# Altium project TIDA-010933-RevA.PrjPcb (part 7 of 8)

## Sheet TIDA-010933-DCAC-SWITCHING-STAGE.SchDoc
size 558 x 431 mm; Date: Not shown in title block; ApprovedBy: Not shown in title block; CheckedBy: Not shown in title block; Author: Not shown in title block; CompanyName: Not shown in title block; Engineer: Not shown in title block; Organization: Not shown in title block; Address1: Not shown in title block; Address2: Not shown in title block; Address3: Not shown in title block; Address4: Not shown in title block; DocumentNumber: 1; Revision: Use project parameter SCH_Rev; SheetNumber: 11; SheetTotal: 11; PageSetup: Record=PageOptions|CenterHorizontal=True|CenterVertical=True|PrintScale=1.00|XCorrection=1.00|YCorrection=1.00|PrintKind=0|BorderSize=5000000|LeftOffset=0|BottomOffset=0|Orientation=2|PaperLength=1000|PaperWidth=1000|Scale=100|PaperSource=15|PrintQuality=600|MediaType=1|DitherType=10|PaperKind=Letter|PrintScaleMode=1; CurrentTime: Not shown in title block; CurrentDate: Not shown in title block; Time: Not shown in title block; DocumentFullPathAndName: Not shown in title block; DocumentName: Not shown in title block; ModifiedDate: Not shown in title block; ImagePath: Not shown in title block
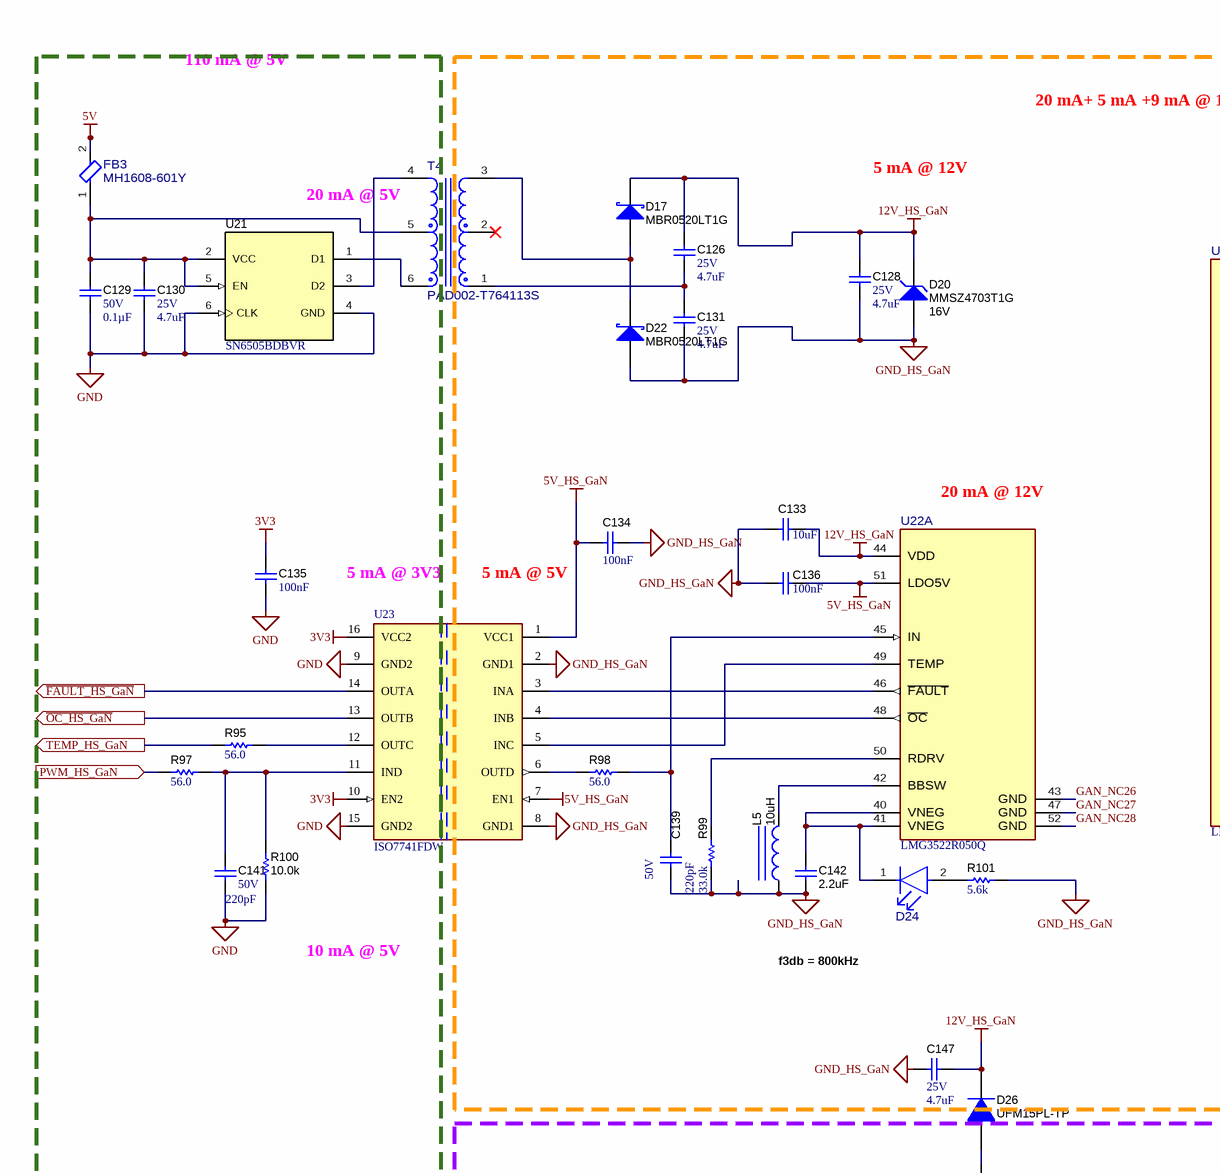
[diagram p12: TIDA-010933-DCAC-SWITCHING-STAGE.SchDoc, top left]
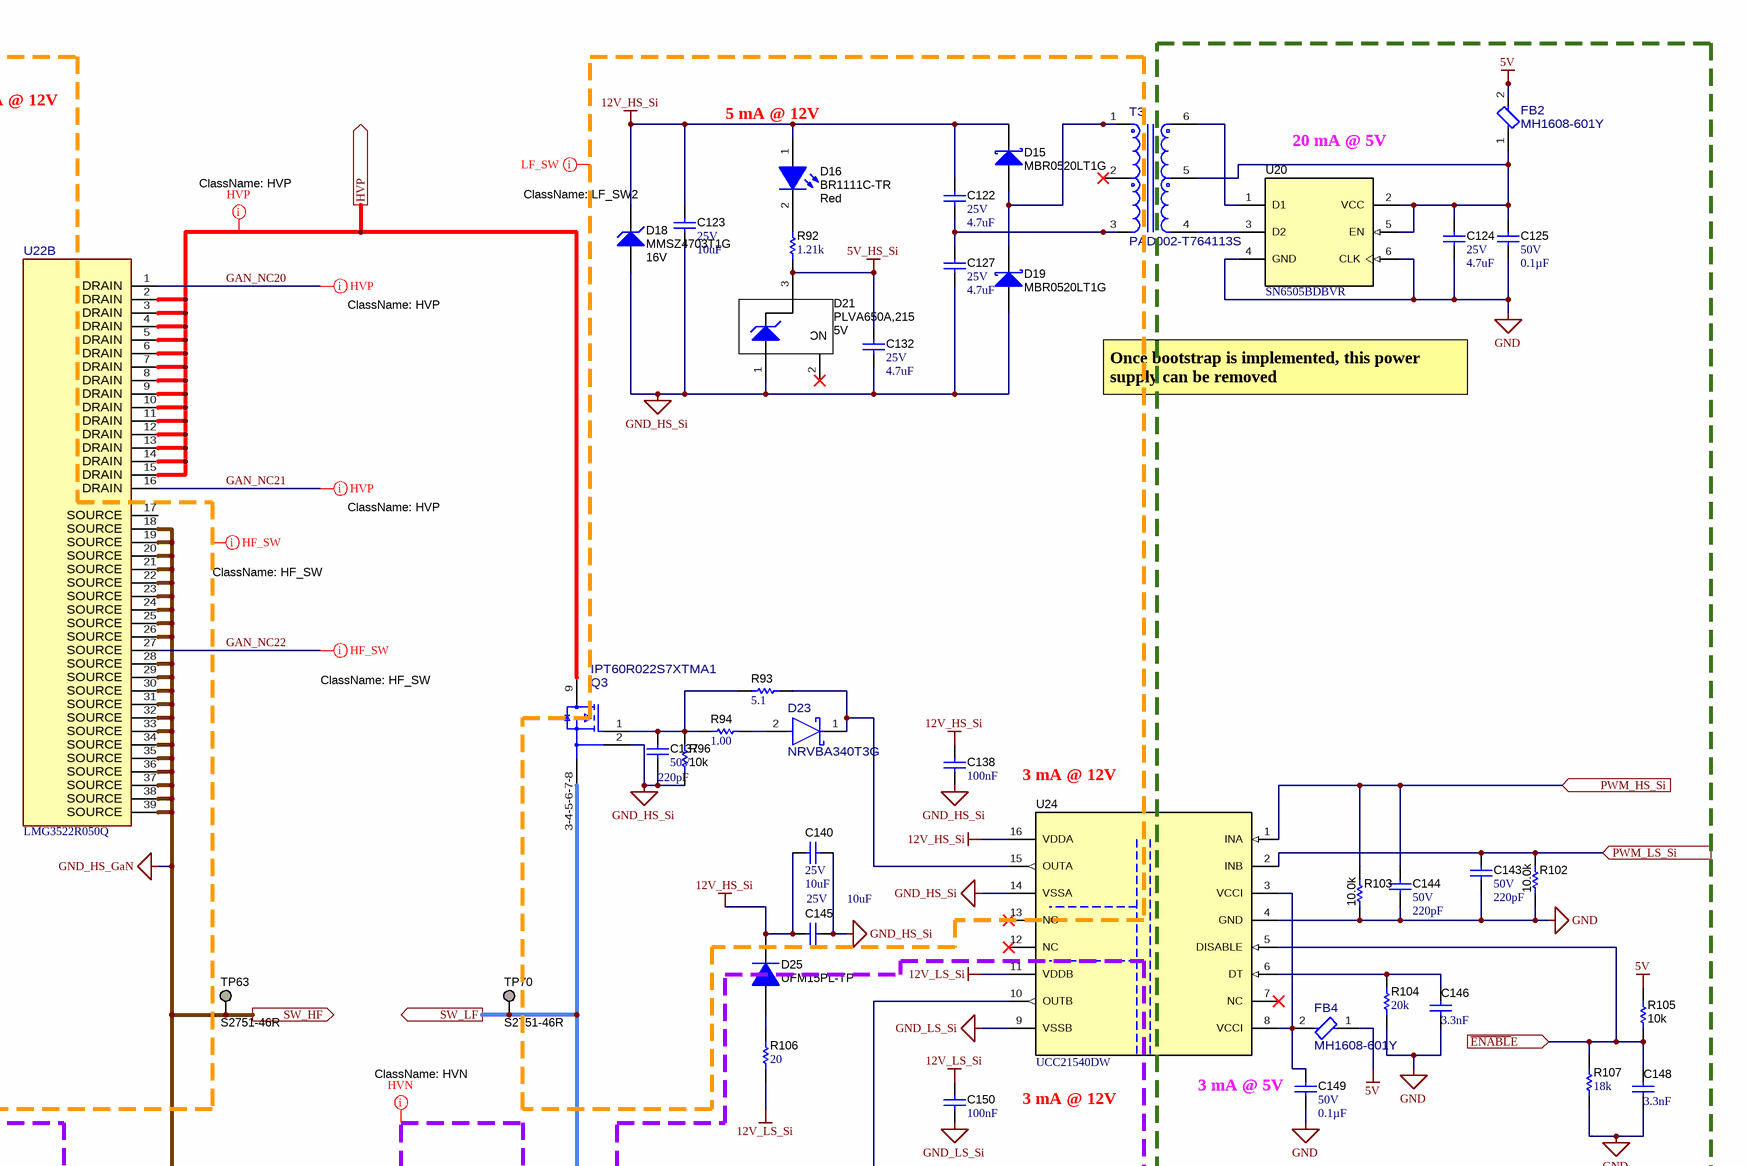
[diagram p13: TIDA-010933-DCAC-SWITCHING-STAGE.SchDoc, top right]
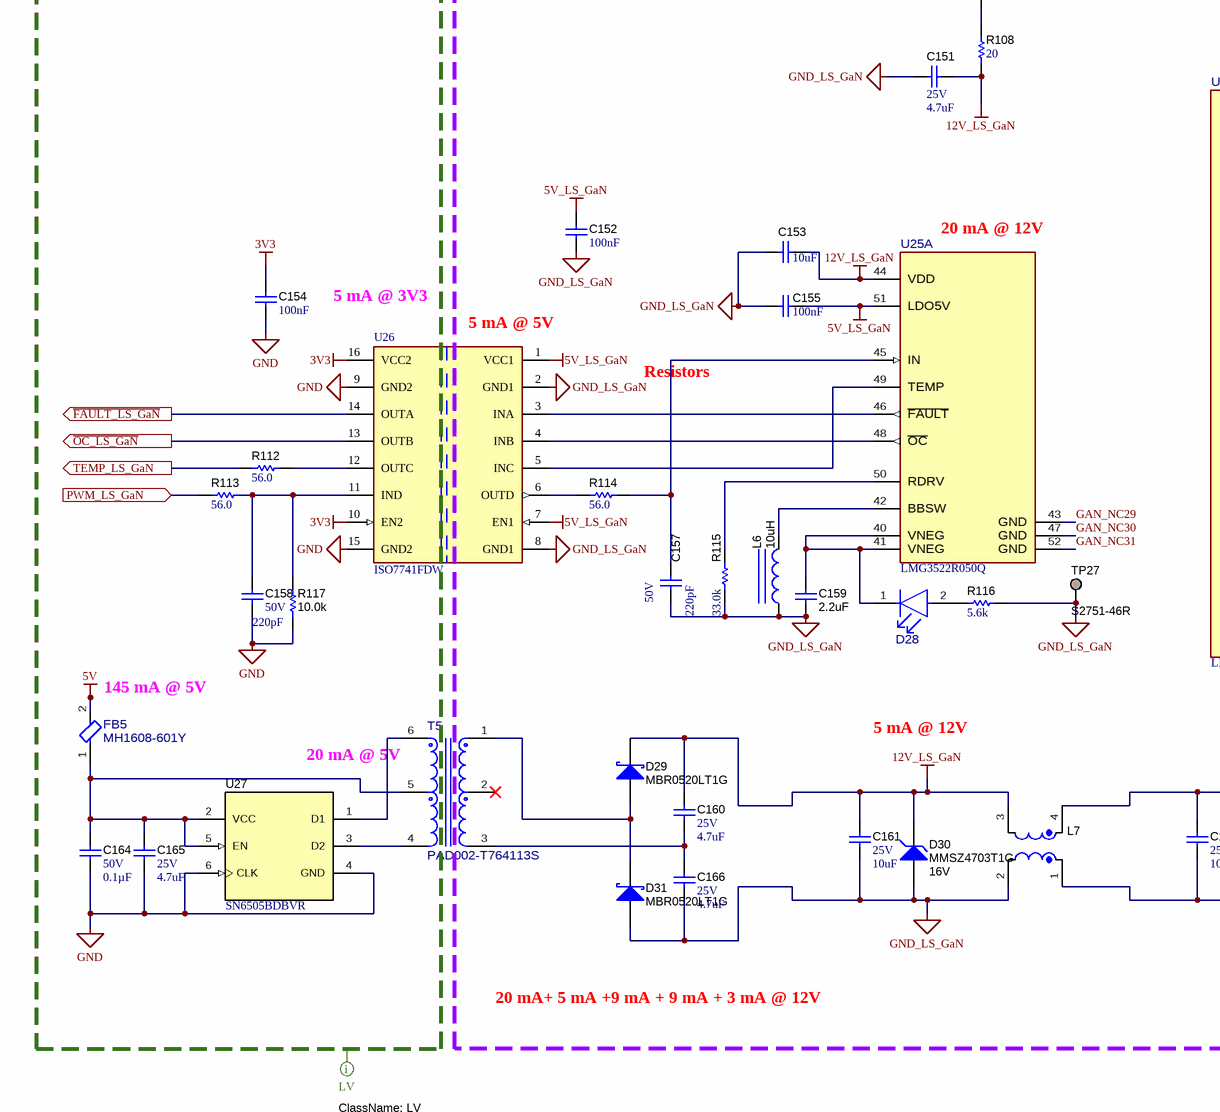
[diagram p14: TIDA-010933-DCAC-SWITCHING-STAGE.SchDoc, bottom left]
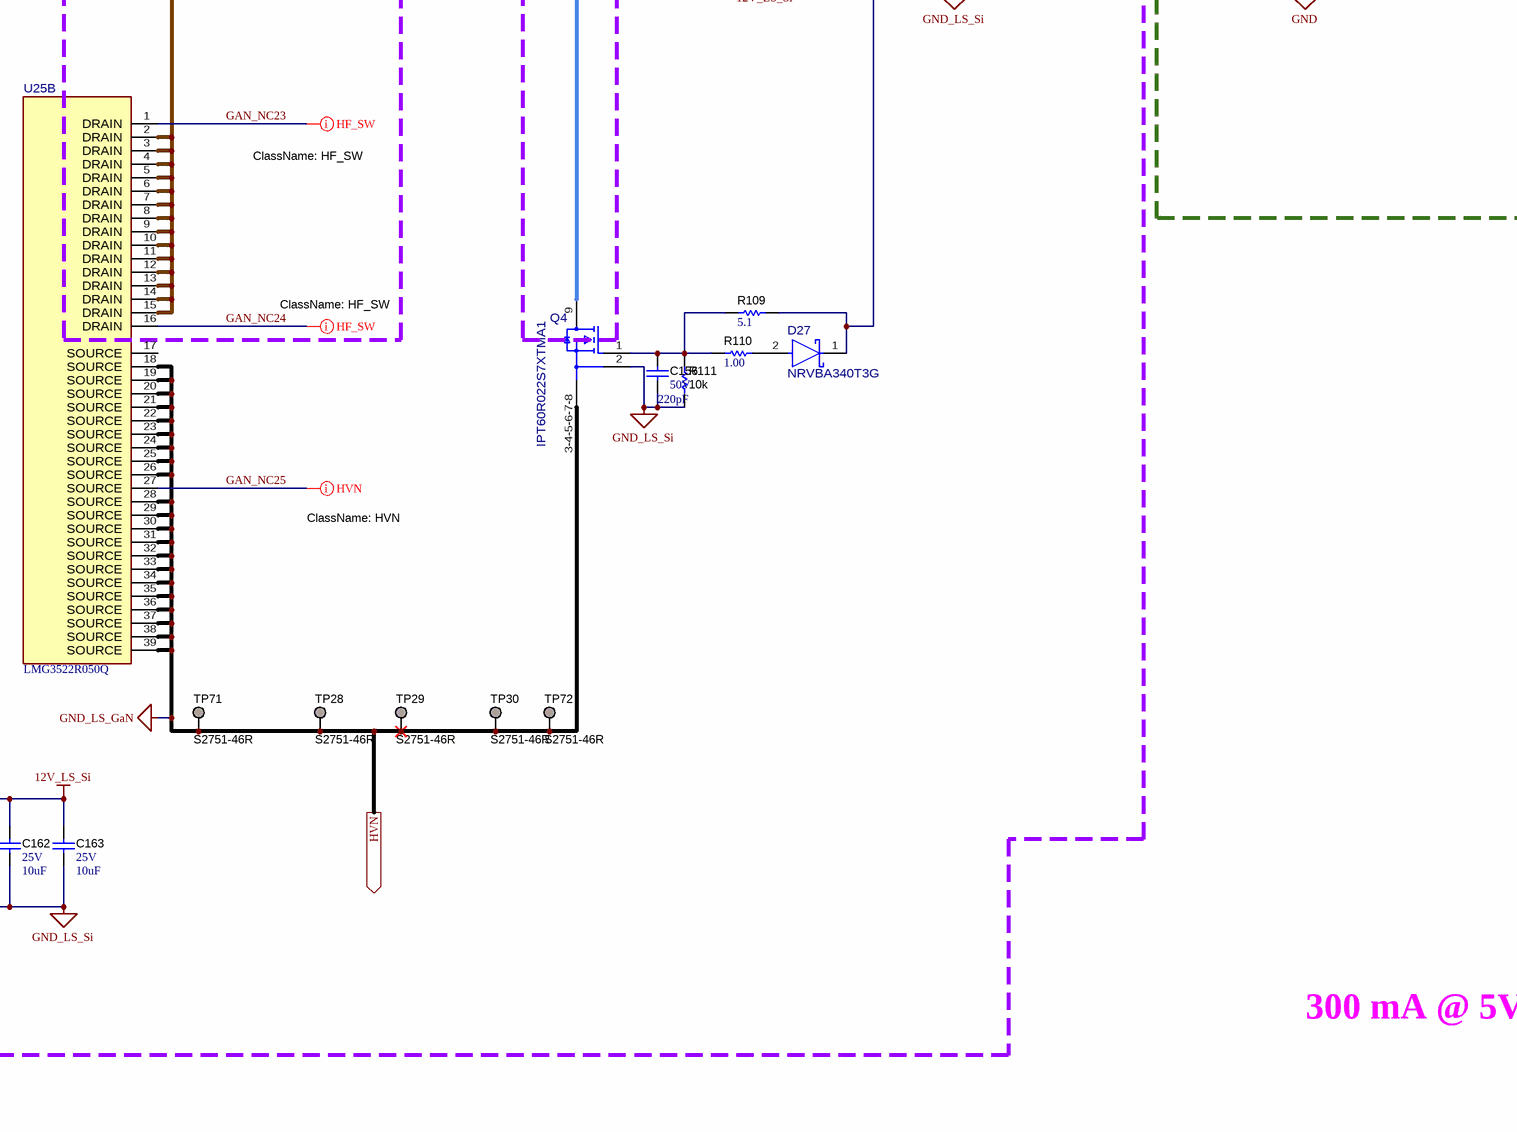
[diagram p15: TIDA-010933-DCAC-SWITCHING-STAGE.SchDoc, bottom right]

### Parts
C122  VDC_V: 25V  ValueDisplayed: 4.7uF  [0603]  (hidden comment: GRM188R61E475KE11D)
C123  VDC_V: 25V  ValueDisplayed: 10uF  [0603]  (hidden comment: GRM188R61E106MA73D)
C124  VDC_V: 25V  ValueDisplayed: 4.7uF  [0603]  (hidden comment: GRM188R61E475KE11D)
C125  VDC_V: 50V  ValueDisplayed: 0.1µF  [0603]  (hidden comment: CGA3E3X8R1H104K080AE)
C126  VDC_V: 25V  ValueDisplayed: 4.7uF  [0603]  (hidden comment: GRM188R61E475KE11D)
C127  VDC_V: 25V  ValueDisplayed: 4.7uF  [0603]  (hidden comment: GRM188R61E475KE11D)
C128  VDC_V: 25V  ValueDisplayed: 4.7uF  [0603]  (hidden comment: GRM188R61E475KE11D)
C129  VDC_V: 50V  ValueDisplayed: 0.1µF  [0603]  (hidden comment: CGA3E3X8R1H104K080AE)
C130  VDC_V: 25V  ValueDisplayed: 4.7uF  [0603]  (hidden comment: GRM188R61E475KE11D)
C131  VDC_V: 25V  ValueDisplayed: 4.7uF  [0603]  (hidden comment: GRM188R61E475KE11D)
C132  VDC_V: 25V  ValueDisplayed: 4.7uF  [0603]  (hidden comment: GRM188R61E475KE11D)
C133  ValueDisplayed: 10uF  [0805_HV]  (hidden comment: GRM219B31E106MA12)
C134  Cap_F: 100nF  [0603]  (hidden comment: 06033C104JAT2A)
C135  Cap_F: 100nF  [0603]  (hidden comment: 06033C104JAT2A)
C136  Cap_F: 100nF  [0603]  (hidden comment: 06033C104JAT2A)
C137  VDC_V: 50V  ValueDisplayed: 220pF  [0603]  (hidden comment: C0603C221K5GACTU)
C138  Cap_F: 100nF  [0603]  (hidden comment: 06033C104JAT2A)
C139  VDC_V: 50V  ValueDisplayed: 220pF  [0603]  (hidden comment: C0603C221K5GACTU)
C140  VDC_V: 25V  ValueDisplayed: 10uF  [0603]  (hidden comment: GRM188R61E106MA73D)
C141  VDC_V: 50V  ValueDisplayed: 220pF  [0603]  (hidden comment: C0603C221K5GACTU)
C142  ValueDisplayed: 2.2uF  [0805_HV]  (hidden comment: GRM21BR71E225KA73L)
C143  VDC_V: 50V  ValueDisplayed: 220pF  [0603]  (hidden comment: C0603C221K5GACTU)
C144  VDC_V: 50V  ValueDisplayed: 220pF  [0603]  (hidden comment: C0603C221K5GACTU)
C145  VDC_V: 25V  ValueDisplayed: 10uF  [0603]  (hidden comment: GRM188R61E106MA73D)
C146  Cap_F: 3.3nF  [0603]  (hidden comment: C0603X332K5RACTU)
C147  VDC_V: 25V  ValueDisplayed: 4.7uF  [0603]  (hidden comment: GRM188R61E475KE11D)
C148  Cap_F: 3.3nF  [0603]  (hidden comment: C0603X332K5RACTU)
C149  VDC_V: 50V  ValueDisplayed: 0.1µF  [0603]  (hidden comment: CGA3E3X8R1H104K080AE)
C150  Cap_F: 100nF  [0603]  (hidden comment: 06033C104JAT2A)
C151  VDC_V: 25V  ValueDisplayed: 4.7uF  [0603]  (hidden comment: GRM188R61E475KE11D)
C152  Cap_F: 100nF  [0603]  (hidden comment: 06033C104JAT2A)
C153  ValueDisplayed: 10uF  [0805_HV]  (hidden comment: GRM219B31E106MA12)
C154  Cap_F: 100nF  [0603]  (hidden comment: 06033C104JAT2A)
C155  Cap_F: 100nF  [0603]  (hidden comment: 06033C104JAT2A)
C156  VDC_V: 50V  ValueDisplayed: 220pF  [0603]  (hidden comment: C0603C221K5GACTU)
C157  VDC_V: 50V  ValueDisplayed: 220pF  [0603]  (hidden comment: C0603C221K5GACTU)
C158  VDC_V: 50V  ValueDisplayed: 220pF  [0603]  (hidden comment: C0603C221K5GACTU)
C159  ValueDisplayed: 2.2uF  [0805_HV]  (hidden comment: GRM21BR71E225KA73L)
C160  VDC_V: 25V  ValueDisplayed: 4.7uF  [0603]  (hidden comment: GRM188R61E475KE11D)
C161  VDC_V: 25V  ValueDisplayed: 10uF  [0603]  (hidden comment: GRM188R61E106MA73D)
C162  VDC_V: 25V  ValueDisplayed: 10uF  [0603]  (hidden comment: GRM188R61E106MA73D)
C163  VDC_V: 25V  ValueDisplayed: 10uF  [0603]  (hidden comment: GRM188R61E106MA73D)
C164  VDC_V: 50V  ValueDisplayed: 0.1µF  [0603]  (hidden comment: CGA3E3X8R1H104K080AE)
C165  VDC_V: 25V  ValueDisplayed: 4.7uF  [0603]  (hidden comment: GRM188R61E475KE11D)
C166  VDC_V: 25V  ValueDisplayed: 4.7uF  [0603]  (hidden comment: GRM188R61E475KE11D)
D15  MBR0520LT1G  [SOD-123]
D16  BR1111C-TR  value Red  [1111C_Red]
D17  MBR0520LT1G  [SOD-123]
D18  MMSZ4703T1G  value 16V  [SOD-123]
D19  MBR0520LT1G  [SOD-123]
D20  MMSZ4703T1G  value 16V  [SOD-123]
D21  PLVA650A,215  value 5V  [SOT-23L]
D22  MBR0520LT1G  [SOD-123]
D23  NRVBA340T3G  [FP-NRVBA340T3G_SMA-MFG]
D24  KG DELLS1.22-JGKH-24  [FP-KG DELLS1.22-JGKH-24_0603-MFG]  (value not drawn)
D25  UFM15PL-TP  [SOD-123FL]
D26  UFM15PL-TP  [SOD-123FL]
D27  NRVBA340T3G  [FP-NRVBA340T3G_SMA-MFG]
D28  KG DELLS1.22-JGKH-24  [FP-KG DELLS1.22-JGKH-24_0603-MFG]  (value not drawn)
D29  MBR0520LT1G  [SOD-123]
D30  MMSZ4703T1G  value 16V  [SOD-123]
D31  MBR0520LT1G  [SOD-123]
FB2  MH1608-601Y  [FP-MH1608-601Y_0603-MFG]
FB3  MH1608-601Y  [FP-MH1608-601Y_0603-MFG]
FB4  MH1608-601Y  [FP-MH1608-601Y_0603-MFG]
FB5  MH1608-601Y  [FP-MH1608-601Y_0603-MFG]
L5  ValueDisplayed: 10uH  [WE-LQS_2010]  (hidden comment: 74404020100)
L6  ValueDisplayed: 10uH  [WE-LQS_2010]  (hidden comment: 74404020100)
L7  SRF2012-361YA  [SRF2012A]  (value not drawn)
Q3  IPT60R022S7XTMA1  [FP-IPT60R022S7XTMA1_HSOF8-MFG]
Q4  IPT60R022S7XTMA1  [FP-IPT60R022S7XTMA1_HSOF8-MFG]
R92  ValueDisplayed: 1.21k  [0805_HV]  (hidden comment: CRCW08051K21FKEA)
R93  ValueDisplayed: 5.1  [0603]  (hidden comment: CRCW06035R10JNEA)
R94  ValueDisplayed: 1.00  [0603]  (hidden comment: CRCW06031R00FKEA)
R95  ValueDisplayed: 56.0  [0603]  (hidden comment: RC0603FR-0756RL)
R96  ValueDisplayed: 10k  [0603]  (hidden comment: CRCW060310K0JNEA)
R97  ValueDisplayed: 56.0  [0603]  (hidden comment: RC0603FR-0756RL)
R98  ValueDisplayed: 56.0  [0603]  (hidden comment: RC0603FR-0756RL)
R99  ValueDisplayed: 33.0k  [0603]  (hidden comment: RC0603FR-0733KL)
R100  ValueDisplayed: 10.0k  [0603]  (hidden comment: CRCW060310K0FKEA)
R101  ValueDisplayed: 5.6k  [0603]  (hidden comment: RC0603JR-075K6L)
R102  ValueDisplayed: 10.0k  [0603]  (hidden comment: CRCW060310K0FKEA)
R103  ValueDisplayed: 10.0k  [0603]  (hidden comment: CRCW060310K0FKEA)
R104  ValueDisplayed: 20k  [0603]  (hidden comment: CRCW060320K0JNEA)
R105  ValueDisplayed: 10k  [0603]  (hidden comment: CRCW060310K0JNEA)
R106  ValueDisplayed: 20  [0603]  (hidden comment: CRCW060320R0JNEA)
R107  ValueDisplayed: 18k  [0603]  (hidden comment: RC0603JR-0718KL)
R108  ValueDisplayed: 20  [0603]  (hidden comment: CRCW060320R0JNEA)
R109  ValueDisplayed: 5.1  [0603]  (hidden comment: CRCW06035R10JNEA)
R110  ValueDisplayed: 1.00  [0603]  (hidden comment: CRCW06031R00FKEA)
R111  ValueDisplayed: 10k  [0603]  (hidden comment: CRCW060310K0JNEA)
R112  ValueDisplayed: 56.0  [0603]  (hidden comment: RC0603FR-0756RL)
R113  ValueDisplayed: 56.0  [0603]  (hidden comment: RC0603FR-0756RL)
R114  ValueDisplayed: 56.0  [0603]  (hidden comment: RC0603FR-0756RL)
R115  ValueDisplayed: 33.0k  [0603]  (hidden comment: RC0603FR-0733KL)
R116  ValueDisplayed: 5.6k  [0603]  (hidden comment: RC0603JR-075K6L)
R117  ValueDisplayed: 10.0k  [0603]  (hidden comment: CRCW060310K0FKEA)
T3  PAD002-T764113S  [FP-PAD002-T764113S_SMT_XFRMR_7MM1_6MM5-MFG]
T4  PAD002-T764113S  [FP-PAD002-T764113S_SMT_XFRMR_7MM1_6MM5-MFG]
T5  PAD002-T764113S  [FP-PAD002-T764113S_SMT_XFRMR_7MM1_6MM5-MFG]
TP27  S2751-46R  [Harwin_S2751-46R]  (no BOM)
TP28  S2751-46R  [Harwin_S2751-46R]  (no BOM)
TP29  S2751-46R  [Harwin_S2751-46R]  (no BOM)
TP30  S2751-46R  [Harwin_S2751-46R]  (no BOM)
TP63  S2751-46R  [Harwin_S2751-46R]  (no BOM)
TP70  S2751-46R  [Harwin_S2751-46R]  (no BOM)
TP71  S2751-46R  [Harwin_S2751-46R]  (no BOM)
TP72  S2751-46R  [Harwin_S2751-46R]  (no BOM)
U20  SN6505BDBVR  [DBV0006A_L]
U21  SN6505BDBVR  [DBV0006A_L]
U22  PartNumber: LMG3522R050Q  [RQS0052C-C01-MFG]  (hidden comment: LMG3522R030Q)  (parts A,B of 2)
U23  ISO7741FDW  [FP-DW0016A-IPC_A]
U24  UCC21540DW  [DW0016B_HV]
U25  PartNumber: LMG3522R050Q  [RQS0052C-C01-MFG]  (hidden comment: LMG3522R030Q)  (parts A,B of 2)
U26  ISO7741FDW  [FP-DW0016A-IPC_A]
U27  SN6505BDBVR  [DBV0006A_L]

### Ports
HVN (out), HVP (out), PWM_HS_GaN (in), PWM_HS_Si (in), PWM_LS_GaN (in), PWM_LS_Si (in), SW_HF (out), SW_LF (out), TEMP_HS_GaN (out), TEMP_LS_GaN (out), ~{ENABL}E (in), ~{FAULT_HS_GaN} (out), ~{FAULT_LS_GaN} (out), ~{OC_HS_GaN} (out), ~{OC_LS_GaN} (out)

### Nets
3V3: C135.1 C154.1 U23.10(EN2) U23.16(VCC2) U26.10(EN2) U26.16(VCC2)
5V: FB2.2 FB3.2 FB4.1 FB5.2 R105.2
5V_HS_GaN: C134.1 C136.2 U22.51(LDO5V) U23.1(VCC1) U23.7(EN1)
5V_HS_Si: C132.1 D21.3(K) R92.1
5V_LS_GaN: C152.2 C155.2 U25.51(LDO5V) U26.1(VCC1) U26.7(EN1)
12V_HS_GaN: C126.1 C128.1 C133.2 C147.1 D17.1(K) D20.1(K) D26.1(K) U22.44(VDD)
12V_HS_Si: C122.1 C123.1 C138.2 C140.1 C145.2 D15.1(K) D16.1(A) D18.1(K) D25.1(K) U24.16(VDDA)
12V_LS_GaN: C151.1 C153.2 C160.1 C161.2 D29.1(K) D30.1(K) L7.3 R108.1 U25.44(VDD)
12V_LS_Si: C150.2 C162.2 C163.2 L7.4 R106.1 U24.11(VDDB)
GND: C124.2 C125.2 C129.2 C130.2 C135.2 C141.2 C143.2 C144.2 C146.2 C148.2 C149.2 C154.2 C158.2 C164.2 C165.2 R100.1 R102.1 R103.1 R104.1 R107.1 R117.1 U20.4(GND) U20.6(CLK) U21.4(GND) U21.6(CLK) U23.9(GND2) U23.15(GND2) U24.4(GND) U26.9(GND2) U26.15(GND2) U27.4(GND) U27.6(CLK)
GND_HS_GaN: C128.2 C131.2 C133.1 C134.2 C136.1 C139.2 C142.2 C147.2 D20.2(A) D22.2(A) L5.1 R99.2 R101.1 TP63.1 U22.18(SOURCE) U22.19(SOURCE) U22.20(SOURCE) U22.21(SOURCE) U22.22(SOURCE) U22.23(SOURCE) U22.24(SOURCE) U22.25(SOURCE) U22.26(SOURCE) U22.28(SOURCE) U22.29(SOURCE) U22.30(SOURCE) U22.31(SOURCE) U22.32(SOURCE) U22.33(SOURCE) U22.34(SOURCE) U22.35(SOURCE) U22.36(SOURCE) U22.37(SOURCE) U22.38(SOURCE) U22.39(SOURCE) U23.2(GND1) U23.8(GND1) U25.2(DRAIN) U25.3(DRAIN) U25.4(DRAIN) U25.5(DRAIN) U25.6(DRAIN) U25.7(DRAIN) U25.8(DRAIN) U25.9(DRAIN) U25.10(DRAIN) U25.11(DRAIN) U25.12(DRAIN) U25.13(DRAIN) U25.14(DRAIN) U25.15(DRAIN) ; port SW_HF
GND_HS_Si: C123.2 C127.2 C132.2 C137.2 C138.1 C140.2 C145.1 D18.2(A) D19.2(A) D21.1(A) Q3.2(Driver_Source) Q3.3-4-5-6-7-8(Source) Q4.9(Drain) R96.1 TP70.1 U24.14(VSSA) ; port SW_LF
GND_LS_GaN: C151.2 C152.1 C153.1 C155.1 C157.2 C159.2 C161.1 C166.2 D30.2(A) D31.2(A) L6.1 L7.2 Q4.3-4-5-6-7-8(Source) R115.2 R116.1 TP27.1 TP28.1 TP29.1 TP30.1 TP71.1 TP72.1 U25.18(SOURCE) U25.19(SOURCE) U25.20(SOURCE) U25.21(SOURCE) U25.22(SOURCE) U25.23(SOURCE) U25.24(SOURCE) U25.25(SOURCE) U25.26(SOURCE) U25.28(SOURCE) U25.29(SOURCE) U25.30(SOURCE) U25.31(SOURCE) U25.32(SOURCE) U25.33(SOURCE) U25.34(SOURCE) U25.35(SOURCE) U25.36(SOURCE) U25.37(SOURCE) U25.38(SOURCE) U25.39(SOURCE) U26.2(GND1) U26.8(GND1) ; port HVN  [project net HVN]
GND_LS_Si: C150.1 C156.2 C162.1 C163.1 L7.1 Q4.2(Driver_Source) R111.1 U24.9(VSSB)
DCLINK+_HV: Q3.9(Drain) U22.2(DRAIN) U22.3(DRAIN) U22.4(DRAIN) U22.5(DRAIN) U22.6(DRAIN) U22.7(DRAIN) U22.8(DRAIN) U22.9(DRAIN) U22.10(DRAIN) U22.11(DRAIN) U22.12(DRAIN) U22.13(DRAIN) U22.14(DRAIN) U22.15(DRAIN) ; port HVP
~{ENABL}E: C148.1 R105.1 R107.2 U24.5(DISABLE) ; port ~{ENABL}E
~{FAULT_HS_GaN}: U23.14(OUTA) ; port ~{FAULT_HS_GaN}
~{FAULT_LS_GaN}: U26.14(OUTA) ; port ~{FAULT_LS_GaN}
GAN_NC20: U22.1(DRAIN)
GAN_NC21: U22.16(DRAIN)
GAN_NC22: U22.27(SOURCE)
GAN_NC23: U25.1(DRAIN)
GAN_NC24: U25.16(DRAIN)
GAN_NC25: U25.27(SOURCE)
GAN_NC26: U22.43(GND)
GAN_NC27: U22.47(GND)
GAN_NC28: U22.52(GND)
GAN_NC29: U25.43(GND)
GAN_NC30: U25.47(GND)
GAN_NC31: U25.52(GND)
~{OC_HS_GaN}: U23.13(OUTB) ; port ~{OC_HS_GaN}
~{OC_LS_GaN}: U26.13(OUTB) ; port ~{OC_LS_GaN}
PWM_HS_GaN: R97.1 ; port PWM_HS_GaN
PWM_HS_Si: C144.1 R103.2 U24.1(INA) ; port PWM_HS_Si
PWM_LS_GaN: R113.1 ; port PWM_LS_GaN
PWM_LS_Si: C143.1 R102.2 U24.2(INB) ; port PWM_LS_Si
TEMP_HS_GaN: R95.1 ; port TEMP_HS_GaN
TEMP_LS_GaN: R112.1 ; port TEMP_LS_GaN
NetC122_2: C122.2 C127.1 T3.3
NetC124_1: C124.1 C125.1 FB2.1 T3.5 U20.2(VCC) U20.5(EN)
NetC126_2: C126.2 C131.1 T4.1
NetC129_1: C129.1 C130.1 FB3.1 T4.5 U21.2(VCC) U21.5(EN)
NetC137_1: C137.1 Q3.1(Gate) R93.1 R94.1 R96.2
NetC139_1: C139.1 R98.2 U22.45(IN)
NetC141_1: C141.1 R97.2 R100.2 U23.11(IND)
NetC142_1: C142.1 D24.1(CATHODE) U22.40(VNEG) U22.41(VNEG)
NetC146_1: C146.1 R104.2 U24.6(DT)
NetC149_1: C149.1 FB4.2 U24.3(VCCI) U24.8(VCCI)
NetC156_1: C156.1 Q4.1(Gate) R109.1 R110.1 R111.2
NetC157_1: C157.1 R114.2 U25.45(IN)
NetC158_1: C158.1 R113.2 R117.2 U26.11(IND)
NetC159_1: C159.1 D28.1(CATHODE) U25.40(VNEG) U25.41(VNEG)
NetC160_2: C160.2 C166.1 T5.3
NetC164_1: C164.1 C165.1 FB5.1 T5.5 U27.2(VCC) U27.5(EN)
NetD15_2: D15.2(A) D19.1(K) T3.1
NetD16_2: D16.2(K) R92.2
NetD17_2: D17.2(A) D22.1(K) T4.3
NetD23_1: D23.1(Cathode) R93.2 U24.15(OUTA)
NetD23_2: D23.2(Anode) R94.2
NetD24_2: D24.2(ANODE) R101.2
NetD25_2: D25.2(A) R106.2
NetD26_2: D26.2(A) R108.2
NetD27_1: D27.1(Cathode) R109.2 U24.10(OUTB)
NetD27_2: D27.2(Anode) R110.2
NetD28_2: D28.2(ANODE) R116.2
NetD29_2: D29.2(A) D31.1(K) T5.1
NetL5_2: L5.2 U22.42(BBSW)
NetL6_2: L6.2 U25.42(BBSW)
NetR95_2: R95.2 U23.12(OUTC)
NetR98_1: R98.1 U23.6(OUTD)
NetR99_1: R99.1 U22.50(RDRV)
NetR112_2: R112.2 U26.12(OUTC)
NetR114_1: R114.1 U26.6(OUTD)
NetR115_1: R115.1 U25.50(RDRV)
NetT3_4: T3.4 U20.3(D2)
NetT3_6: T3.6 U20.1(D1)
NetT4_4: T4.4 U21.3(D2)
NetT4_6: T4.6 U21.1(D1)
NetT5_4: T5.4 U27.3(D2)
NetT5_6: T5.6 U27.1(D1)
NetU22_46: U22.46(~{FAULT}) U23.3(INA)
NetU22_48: U22.48(~{OC}) U23.4(INB)
NetU22_49: U22.49(TEMP) U23.5(INC)
NetU25_46: U25.46(~{FAULT}) U26.3(INA)
NetU25_48: U25.48(~{OC}) U26.4(INB)
NetU25_49: U25.49(TEMP) U26.5(INC)

Not connected (* = marked no-connect by the designer): D21 2(NC)*; T3 2*; T4 2*; T5 2*; U22 17(SOURCE); U24 7(NC)* 12(NC)* 13(NC)*; U25 17(SOURCE)

### Layout directives
net class LV: 3V3, 5V, GND
net class HF_SW: 5V_HS_GaN, 12V_HS_GaN, GAN_NC22, GAN_NC23, GAN_NC24, GAN_NC26, GAN_NC27, GAN_NC28, GND_HS_GaN
net class LF_SW2: 5V_HS_Si, 12V_HS_Si, GND_HS_Si
net class HVN: 5V_LS_GaN, 12V_LS_GaN, 12V_LS_Si, GAN_NC25, GAN_NC29, GAN_NC30, GAN_NC31, GND_LS_GaN, GND_LS_Si
net class HVP: DCLINK+_HV, GAN_NC20, GAN_NC21

### Notes on the sheet
- 110 mA @ 5V
- 20 mA+ 5 mA +9 mA @ 12V
- (near D16) 5 mA @ 12V
- 20 mA @ 5V
- 5 mA @ 12V
- Once bootstrap is implemented, this power supply can be removed
- 20 mA @ 12V
- 5 mA @ 3V3
- 5 mA @ 5V
- 3 mA @ 12V
- 10 mA @ 5V
- f3db = 800kHz
- 3 mA @ 5V
- (near U25) 20 mA @ 12V
- (near U26) 5 mA @ 5V
- Resistors
- (near FB5) 145 mA @ 5V
- 20 mA+ 5 mA +9 mA + 9 mA + 3 mA @ 12V
- 300 mA @ 5V Total
- Drawn By:
- SVN Rev:
- Number:
- TID #:
- Orderable:
- Rev:
- Sheet Title:
- File:
- Project Title:
- Designed for:
- Assembly Variant:
- Mod. Date:
- Sheet:
- Size:
- of
- C
- http://www.ti.com
- Texas Instruments and/or its licensors do not warrant the accuracy or completeness of this specification or any information contained therein. Texas Instruments and/or its licensors do not warrant that this design will meet the specifications, will be suitable for your application or fit for any particular purpose, or will operate in an implementation. Texas Instruments and/or its licensors do not warrant that the design is production worthy. You should completely validate and test your design implementation to confirm the system functionality for your application.
- Engineer:
- Contact:
- © Texas Instruments

### Library data of the parts
C122 C124 C126-C128 C130-C132 C147 C151 C160 C165 C166 = CMP-0007347-5: CAP, CERM, 4.7 uF, 25 V, +/- 10%, X5R, 0603; Manufacturer: MuRata; TaMin_C: -55°C; Polarized: N; SizeAreaWB_mm2: 4.68; Value1: Unknown; U/M: EA; Value: 4.7uF; TaMax_C: 85°C; SizeZ_mm: 1; SizeX_mm: 1.6; SizeY_mm: 0.8; SizeArea_mm2: 1.28; Cap_F: 4.7µF; AEC Category: Q200; Supplier Part Number 2: 68X2788; Supplier 2: Newark; Supplier Part Number 3: 81-GRM188R61E475KE1D; TempCo: X5R; Supplier 3: Mouser; Published: 2008-06-19; RoHS: Y; MountType: SMT; Supplier 1: Digi-Key; Publisher: Texas Instruments; PackageReference: 0603; Tolerance_%: 10%; Cap_Case: 0603; Value2: 25V; CompType: Capacitor; LatestRevisionDate: 2017-03-09; PartNumber: GRM188R61E475KE11D; AEC Qualified: N; ComponentLink1Description: Datasheet link; AEC Grade: N/A; Supplier Part Number 1: 490-7203-1-ND; Technology: Ceramic; ComponentLink1URL: http://search.murata.co.jp/Ceramy/image/img/A01X/G101/ENG/GRM188R61E475KE11-01.pdf
C123 C140 C145 C161-C163 = CMP-0007344-5: CAP, CERM, 10 uF, 25 V, +/- 20%, X5R, 0603; Manufacturer: MuRata; TaMin_C: -55°C; Polarized: N; SizeAreaWB_mm2: 4.68; Value1: Unknown; U/M: EA; Value: 10uF; TaMax_C: 85°C; SizeZ_mm: 1; SizeX_mm: 1.6; SizeY_mm: 0.8; SizeArea_mm2: 1.28; Cap_F: 10µF; AEC Category: Q200; Supplier Part Number 2: 81-GRM188R61E106MA3L; Publisher: Texas Instruments; Supplier 2: Mouser; Supplier Part Number 3: 1828803RL; TempCo: X5R; Supplier 3: Farnell; Published: 2008-06-19; RoHS: Y; MountType: SMT; Supplier 1: Digi-Key; PackageReference: 0603; Tolerance_%: 20%; Cap_Case: 0603; Value2: 25V; CompType: Capacitor; LatestRevisionDate: 2017-03-09; PartNumber: GRM188R61E106MA73D; AEC Qualified: ?; ComponentLink1Description: Datasheet link; Supplier Part Number 1: 490-7202-1-ND; Technology: Ceramic; ComponentLink1URL: http://psearch.murata.com/capacitor/product/GRM188R61E106MA73%23.pdf
C125 C129 C149 C164 = CMP-0079911-1: CAP, CERM, 0.1 µF, 50 V,+/- 10%, X8R, AEC-Q200 Grade 0, 0603; Manufacturer: TDK; Cap_F: 100nF; SizeAreaWB_mm2: 4.68; SizeArea_mm2: 1.28; AEC Qualified: Y; AEC Category: Q200; Value: 0.1uF; TaMax_C: 150°C; SizeZ_mm: 1; AEC Grade: 0; Polarized: N; TaMin_C: -55°C; SizeY_mm: 0.8; U/M: EA; SizeX_mm: 1.6; ComponentLink1Description: Datasheet link; RoHS: Y; Supplier Part Number 3: 810-CGA3E3X8R1H104KA; Tolerance_%: 10%; Supplier 1: Digi-Key; PackageReference: 0603; Technology: Ceramic; PartNumber: CGA3E3X8R1H104K080AE; TempCo: X8R; Supplier Part Number 2: 92Y5509; Supplier 2: Newark; Value2: 50V; ComponentLink1URL: https://product.tdk.com/info/en/catalog/datasheets/mlcc_automotive_soft_en.pdf; CompType: Capacitor; MountType: SMT; Supplier Part Number 1: 445-173697-1-ND; Supplier 3: Mouser; Cap_Case: 0603
C133 C153 = CMP-0008183-2: CAP, CERM, 10 uF, 25 V, +/- 20%, B, 0805; Manufacturer: MuRata; TaMin_C: -25°C; Polarized: N; SizeAreaWB_mm2: 6.75; Value1: Unknown; U/M: EA; Value: 10uF; TaMax_C: 85°C; SizeZ_mm: 1.45; SizeX_mm: 2; SizeY_mm: 1.25; Cap_Case: 0805; Value2: 25V; SizeArea_mm2: 2.5; Cap_F: 10µF; AEC Category: Q200; Publisher: Texas Instruments; TempCo: B; Published: 2008-06-19; RoHS: Y; MountType: SMT; PackageReference: 0805; Tolerance_%: 20%; CompType: Capacitor; LatestRevisionDate: 2017-03-09; PartNumber: GRM219B31E106MA12; AEC Qualified: N; VDC_V: 25V; ComponentLink1Description: Datasheet link; AEC Grade: N/A; Technology: Ceramic; ComponentLink1URL: http://www.murata.com/~/media/webrenewal/support/library/catalog/products/capacitor/mlcc/c02e.ashx
C134-C136 C138 C150 C152 C154 C155 = CMP-0006752-5: CAP, CERM, 0.1 uF, 25 V, +/- 5%, X7R, 0603; Manufacturer: AVX; TaMin_C: -55°C; ESR_ohm: 0.05; Polarized: N; SizeAreaWB_mm2: 4.68; Value1: 0.05 ohm; U/M: EA; Value: 0.1uF; TaMax_C: 125°C; SizeZ_mm: 1; SizeX_mm: 1.6; SizeY_mm: 0.8; Value2: 25V; SizeArea_mm2: 1.28; AEC Category: Q200; Supplier Part Number 2: 581-06033C104JAT2A; Publisher: Texas Instruments; Supplier 2: Mouser; Supplier Part Number 3: 1740614; TempCo: X7R; Supplier 3: Farnell; Published: 2008-06-19; RoHS: Y; MountType: SMT; Supplier 1: Digi-Key; PackageReference: 0603; Tolerance_%: 5%; Cap_Case: 0603; CompType: Capacitor; LatestRevisionDate: 2017-03-09; PartNumber: 06033C104JAT2A; AEC Qualified: N; VDC_V: 25V; ComponentLink1Description: Datasheet link; AEC Grade: N/A; Supplier Part Number 1: 478-3713-1-ND; Technology: Ceramic; ValueDisplayed: 0.1uF; ComponentLink1URL: http://datasheets.avx.com/X7RDielectric.pdf
C137 C139 C141 C143 C144 C156-C158 = CMP-0006894-4: CAP, CERM, 220 pF, 50 V, +/- 10%, C0G/NP0, 0603; Manufacturer: Kemet; TaMin_C: -55°C; Polarized: N; SizeAreaWB_mm2: 4.68; Value1: Unknown; U/M: EA; Value: 220pF; TaMax_C: 125°C; SizeZ_mm: 1; SizeX_mm: 1.6; SizeY_mm: 0.8; SizeArea_mm2: 1.28; AEC Category: Q200; Supplier Part Number 2: 80-C0603C221K5G; Publisher: Texas Instruments; Supplier 2: Mouser; Supplier Part Number 3: 1167797; TempCo: C0G/NP0; Supplier 3: Farnell; Published: 2008-06-19; RoHS: Y; MountType: SMT; Supplier 1: Digi-Key; PackageReference: 0603; Tolerance_%: 10%; Cap_Case: 0603; Value2: 50V; CompType: Capacitor; LatestRevisionDate: 2017-03-09; PartNumber: C0603C221K5GACTU; AEC Qualified: ?; Cap_F: 220pF; ComponentLink1Description: Datasheet link; Supplier Part Number 1: 399-1065-1-ND; Technology: Ceramic; ComponentLink1URL: http://www.kemet.com/kemet/web/homepage/kechome.nsf/vapubfiles/F3102_Y5V.pdf/$file/F3102_Y5V.pdf
C142 C159 = CMP-0008342-2: CAP, CERM, 2.2 uF, 25 V, +/- 10%, X7R, 0805; Manufacturer: MuRata; Alternate PartNumber: GRM219R61E225KA12D; Polarized: N; Value: 2.2uF; U/M: EA; Cap_F: 2.2µF; ESR_ohm: 5m; Value1: 0.005 ohm; VDC_V: 25V; TaMin_C: -55°C; TaMax_C: 125°C; Cap_Case: 0805; SizeArea_mm2: 2.5; SizeAreaWB_mm2: 6.75; SizeX_mm: 2; SizeY_mm: 1.25; SizeZ_mm: 1.45; AEC Category: Q200; CompType: Capacitor; PartNumber: GRM21BR71E225KA73L; PackageReference: 0805; RoHS: Y; Tolerance_%: 10%; Value2: 25V; MountType: SMT; Technology: Ceramic; TempCo: X7R; Published: 2008-06-19; Publisher: Texas Instruments; LatestRevisionDate: 2017-03-09; ComponentLink1Description: Datasheet link; ComponentLink1URL: http://search.murata.co.jp/Ceramy/PnsearchViewAction.do?HnOFG=ON&HnNFG=ON&SEL_CNT=50&sLang=en&sKey=GRM21BR71E225KA73L&x=9&y=9&search=startwith; Alternate Manufacturer: Murata; Supplier 1: Digi-Key; Supplier Part Number 1: 490-3331-1-ND; Supplier 2: Mouser; Supplier Part Number 2: 81-GRM21BR71E225KA73; Supplier 3: Farnell; Supplier Part Number 3: 1735542; AEC Qualified: ?
C146 C148 = CMP-0006985-4: CAP, CERM, 3300 pF, 50 V, +/- 10%, X7R, 0603; Manufacturer: Kemet; TaMin_C: -55°C; Polarized: N; SizeAreaWB_mm2: 4.68; Value1: Unknown; U/M: EA; Value: 3300pF; TaMax_C: 125°C; SizeZ_mm: 1; SizeX_mm: 1.6; SizeY_mm: 0.8; Value2: 50V; SizeArea_mm2: 1.28; AEC Category: Q200; Supplier Part Number 2: 80-C0603X332K5R; Publisher: Texas Instruments; Supplier 2: Mouser; TempCo: X7R; Published: 2008-06-19; RoHS: Y; MountType: SMT; Supplier 1: Digi-Key; PackageReference: 0603; Tolerance_%: 10%; Cap_Case: 0603; CompType: Capacitor; LatestRevisionDate: 2017-03-09; PartNumber: C0603X332K5RACTU; AEC Qualified: ?; VDC_V: 50V; ComponentLink1Description: Datasheet link; Supplier Part Number 1: 399-5339-1-ND; Technology: Ceramic; ValueDisplayed: 3300pF; ComponentLink1URL: http://www.kemet.com/kemet/web/homepage/kechome.nsf/vapubfiles/F3102_Y5V.pdf/$file/F3102_Y5V.pdf
D15 D17 D19 D22 D29 D31 = CMP-0028524-2: Diode, Schottky, 20 V, 0.5 A, SOD-123; Manufacturer: ON Semiconductor; Green_REACh: Passed; TJmax_C: 125°C; Value1: 0.5A; SizeZ_mm: 1.35; Value2: 0.385V; Vf_V: 385mV; AEC Category: Q101; SizeY_mm: 1.7; Value: 20V; Io_A: 500mA; SizeX_mm: 3.85; Green_Lifecycle: Active; RJC_CperW: 150; SizeAreaWB_mm2: 13.095; SizeArea_mm2: 6.545; ComponentLink1URL: http://www.onsemi.com/pub_link/Collateral/MBR0520LT1-D.PDF; ComponentLink1Description: Datasheet link; Green_EU RoHS-2: Passed; CompType: Diode; PartNumber: MBR0520LT1G; RoHS: Y; AEC Qualified: ?; MountType: SMT; Type: Schottky; Green_EU RoHS: Passed; Vr_V: 20V; PackageReference: SOD-123
D16 = CMP-0002972-3: LED, Red, SMD; Manufacturer: Stanley Electric Co., LTD; Tjmax_C: 85°C; Ir_A: 100µA; Power_TotalModule: 57.5mW; Value2: 1.7V; Io_A: 20mA; Value1: 0.0575W; Vr_V: 4V; Color: Red; RoHS: Y; ComponentLink1URL: https://sps06.itg.ti.com/sites/KMS/crossdivteams/altium/docs/ComponentDatasheets/BR1111C-TR.pdf; PartNumber: BR1111C-TR; PackageReference: 1.6x0.8mm; Type: ?; MountType: SMT; ComponentLink1Description: Datasheet link; Vf_V: 1.7V; CompType: LED
D18 D20 D30 = CMP-0005746-4: Diode, Zener, 16 V, 500 mW, SOD-123; Manufacturer: ON Semiconductor; SizeY_mm: 1.7; RJA_CperW: 340; Power_W: 500mW; SizeArea_mm2: 6.545; SizeX_mm: 3.85; SizeAreaWB_mm2: 13.095; Value1: 0.5W; AEC Category: Q101; SizeZ_mm: 1.35; AEC Qualified: ?; Vz_V: 16V; MountType: SMT; CompType: Zener; ComponentLink1Description: Datasheet link; ComponentLink1URL: http://www.onsemi.com/pub_link/Collateral/MMSZ4678T1-D.PDF; PackageReference: SOD-123; PartNumber: MMSZ4703T1G; RoHS: Y
D21 = CMP-0065109-3: Diode, Zener, 5 V, 250 mW, SOT-23; Manufacturer: Nexperia; SizeArea_mm2: 7.5; SizeY_mm: 3.0; RJA_CperW: 500; AEC Category: Q101; Power_W: 250mW; SizeZ_mm: 1.1; SizeAreaWB_mm2: 14.0; SizeX_mm: 2.5; Value1: 0.25W; AEC Qualified: N; MountType: SMT; PackageReference: SOT-23; PartNumber: PLVA650A,215; RoHS: Y; CompType: Zener; ComponentLink1URL: http://assets.nexperia.com/documents/data-sheet/PLVA6XXA_SERIES.pdf; ComponentLink1Description: Datasheet link; Vz_V: 5V
D23 D27 = CMP-0090591-1: Diode Schottky 40V 3A Surface Mount SMA; Manufacturer: ON Semiconductor; TJmax_C: 150°C; Peak Reverse Current: 0.3mA; Import Ts: 1521842727; Ciiva Ids: 822566; Max Surge Forward Current: 100A; AEC Qualified: Yes; SizeZ_mm: 2.2mm; AEC Grade: Grade 0; Standoff Height: 0.05mm; PackageReference: SMA; Lead Free: Yes; ComponentLink1URL: https://www.onsemi.com/pub/Collateral/MBRA340T3-D.PDF; Datasheet Path: datasheets/Diode-NRVBA340T3G.pdf; Mouser Part Number: 863-NRVBA340T3G; datasheet: https://www.onsemi.com/pub/Collateral/MBRA340T3-D.PDF; Release Date: 1407122961; ComponentLink1Description: Datasheet; Digikey Part Number: NRVBA340T3GOSCT-ND; PartNumber: NRVBA340T3G; RoHS: TRUE; Vf_V: 40V; Mouser Description: ON Semi NRVBA340T3G; SMT Schottky Diode; 40V 3A; 2-Pin DO-214AC; Digikey Description: DIODE SCHOTTKY 40V 3A SMA; Operating Temperature Range: -55°C to +150°C; Vr_V: 40V; Part Number: NRVBA340T3G; helpURL: https://upverter.com/upn/revision/a5a21e24fb3c0a8a/; Vault Guid: 85F22403-B115-4139-8CC6-3EA1D67971E9; Forward Current: 3A
D24 D28 = CMP-0093310-1: Standard LEDs - SMD Green TOPLED E 1608; Manufacturer: Osram Opto; AEC Grade: Grade 2; LambdaP: 572nm; SizeZ_mm: 0.7mm; LuminousFlux_PhiV: 0.016-0.0295lm; Luminous Intensity: 4.5-9.7mcd; LambdaD: 570nm; Tjmax_C: 125°C; Angle: 120°; Led Orientation: Top View; Forward Current: 2mA; Vf_V: 1.8V; AEC Qualified: Yes; Vr_V: 12V; Lead Free: Yes; Part Number: KG DELLS1.22-JGKH-24; ComponentLink1URL: https://dammedia.osram.info/media/resource/hires/osram-dam-5423212/KG%20DELLS1.22_EN.pdf; Mouser Description: Topled E1608 Grn SMT; helpURL: https://upverter.com/upn/revision/bca93164397fc6ea/; PackageReference: 0603; ComponentLink1Description: Datasheet; PartNumber: KG DELLS1.22-JGKH-24; Datasheet Path: datasheets/Diode-KG DELLS1.22-JGKH-24.pdf; RoHS: TRUE; Mouser Part Number: 720-KGDELLS122A4849; Operating Temperature Range: -40°C to +110°C; datasheet: https://dammedia.osram.info/media/resource/hires/osram-dam-5423212/KG%20DELLS1.22_EN.pdf; Color: Green
D25 D26 = CMP-0029148-2: Diode, Ultrafast, 600 V, 1 A, SOD-123FL; Manufacturer: Micro Commercial Components; SizeY_mm: 1.65; Value: 600V; Io_A: 1A; Green_Lifecycle: Not Set; Green_REACh: Incomplete; SizeX_mm: 3.6; SizeAreaWB_mm2: 12.19; SizeArea_mm2: 5.94; AEC Qualified: N; Value2: 1.7V; SizeZ_mm: 0.98; AEC Category: Q101; TJmax_C: 150°C; Green_EU RoHS-2: Incomplete; MountType: SMT; Type: Ultrafast; ComponentLink1URL: http://www.mccsemi.com/up_pdf/UFM11PL~UFM17PL(SOD-123FL).pdf; CompType: Diode; Vr_V: 600V; ComponentLink1Description: Datasheet link; RoHS: Y; PackageReference: SOD-123FL; Vf_V: 1.7V; Value1: 1A; PartNumber: UFM15PL-TP; Green_EU RoHS: Incomplete
FB2-FB5 = CMP-0037505-1: 600 Ohms @ 100 MHz 1 Power, Signal Line Ferrite Bead 0603 (1608 Metric) 1A 200mOhm; Manufacturer: Bourns; DCR_ohm: 0.2; SizeZ_mm: 1mm; AEC Qualified: No; Impedance At Frequency: 600Ω @ 100MHz; Test Frequency: 100MHz; Tolerance_%: 25%; Imax_A: 1A; PackageReference: 0603; PartNumber: MH1608-601Y; RoHS: TRUE; Supplier 1: Digikey; Supplier 2: Mouser; Supplier Part Number 1: MH1608-601YCT-ND; Supplier Part Number 2: 652-MH1608-601Y; Part Number: MH1608-601Y; datasheet: https://www.bourns.com/docs/Product-Datasheets/mh.pdf; Datasheet Path: datasheets/FBead-MH1608-601Y.pdf; Digikey Description: FERRITE BEAD 600 OHM 0603 1LN; Digikey Part Number: MH1608-601YCT-ND; helpURL: https://upverter.com/upn/revision/07c7dad827ccdff3/; Lead Free: Yes; Material: Ferrite; Mouser Description: Ferrite Beads 600 ohms 25% HIGH CURRENT; Mouser Part Number: 652-MH1608-601Y; Operating Temperature Range: -55°C to +125°C; Technology: Chip; ComponentLink1Description: Datasheet; ComponentLink1URL: https://www.bourns.com/docs/Product-Datasheets/mh.pdf
L5 L6 = CMP-0063789-1: Inductor, 10 uH, 0.5 A, 0.85 ohm, SMD; Manufacturer: Wurth Elektronik; Value: 10uH; Ind_H: 10µH; Imax_A: 5dA; Irms: 0.5A @ 40C rise; Isat: 0.6A @ 30% inductance drop; DCR_ohm: 8.5d; Value2: 0.5A; SizeAreaWB_mm2: 7.8; SizeArea_mm2: 3.2; SizeX_mm: 2; SizeY_mm: 1.6; SizeZ_mm: 1; AEC Category: Q200; AEC Qualified: N; CompType: Inductor; PartNumber: 74404020100; Value1: 0.85 ohm; Technology: ?; MountType: SMT; Material: ?; PackageReference: 2x1.6mm; Published: 2008-06-26; Publisher: Texas Instruments; LatestRevisionDate: 2017-06-02; ComponentLink1Description: Datasheet link; ComponentLink1URL: http://katalog.we-online.com/pbs/datasheet/74404020100.pdf; RoHS: Y; AEC Grade: N/A
L7 = CMP-0058159-1: Inductor, Wirewound, Ferrite, 0.3 A, 0.45 ohm, SMD; Manufacturer: Bourns; Green_Lifecycle: NRND; SizeAreaWB_mm2: 6.6; DCR_ohm: 4.5d; Green_REACh: Passed; Imax_A: 3dA; SizeZ_mm: 1.4; SizeX_mm: 2; SizeY_mm: 1.2; Value2: 0.3A; SizeArea_mm2: 2.4; AEC Category: Q200; ComponentLink1URL: http://www.bourns.com/data/global/pdfs/SRF2012A.pdf; Supplier Part Number 2: 54W0024; Publisher: Texas Instruments; Supplier 2: Newark; Supplier Part Number 3: 652-SRF2012-361YA; Supplier 3: Mouser; Published: 2008-06-26; RoHS: Y; Value1: 0.45 ohm; Material: Ferrite; MountType: SMT; Green_EU RoHS-2: Incomplete; Supplier 1: Digi-Key; Green_EU RoHS: Passed; PackageReference: 2.0x1.2x1.2mm; CompType: Inductor; LatestRevisionDate: 2017-06-02; PartNumber: SRF2012-361YA; AEC Qualified: ?; ComponentLink1Description: Datasheet link; Supplier Part Number 1: SRF2012-361YACT-ND; Technology: Wirewound
Q3 Q4 = CMP-0096632-1: N-Channel 600 V 23A (Tc) 390W (Tc) Surface Mount PG-HSOF-8-2; Manufacturer: Infineon; Reverse Recovery Time: 460ns; QgTyp_nC: 150nC @ 12V; Turn Off Delay Time: 150ns; Pulse Drain Current: 375A; Threshold Vgs Max: 4.5V; Reverse Recovery Charge: 9000nC; Threshold Vgs Min: 3.5V; Typ Forward Diode Voltage: 0.82V; Rdson45_ohm: 20m; Number Of N Channels: 1; Rthja Max: 62°C/W; VdsMax_V: 600V; Input Capacitace At Vds: 5639pF @ 300V; ChMode: False; AEC Qualified: No; SizeZ_mm: 2.4mm; Turn On Delay Time: 30ns; Vgs_V: 20V; TJmax_C: +150°C; Lead Free: Yes; Mouser Part Number: 726-IPT60R022S7XTMA1; ComponentLink1URL: https://www.infineon.com/dgdl/Infineon-IPT60R022S7-DataSheet-v02_00-EN.pdf?fileId=5546d4626bb628d7016bc266c2ec77b5; Digikey Part Number: 448-IPT60R022S7XTMA1CT-ND; datasheet: https://www.infineon.com/dgdl/Infineon-IPT60R022S7-DataSheet-v02_00-EN.pdf?fileId=5546d4626bb628d7016bc266c2ec77b5; Digikey Description: MOSFET N-CH 600V 23A 8HSOF; Operating Temperature Range: -55°C to +150°C; RoHS: TRUE; helpURL: https://upverter.com/upn/revision/39de4432f1c3ff97/; Power_W: 390W; Number Of Channels: 1; PackageReference: HSOF8; PartNumber: IPT60R022S7XTMA1; ComponentLink1Description: Datasheet; Part Number: IPT60R022S7XTMA1; Datasheet Path: datasheets/Trans-IPT60R022S7XTMA1.pdf; Drain To Source Breakdown Voltage: 600V; IdsMax_A: 23A
R92 = CMP-0020959-3: RES, 1.21 k, 1%, 0.125 W, AEC-Q200 Grade 0, 0805; Manufacturer: Vishay-Dale; Power_W: 125mW; TempCo: 100 ppm/C; Value_Code: 1k21; Value: 1.21k; EIA_Code: E96; SizeX_mm: 2; SizeY_mm: 1.25; SizeZ_mm: 1.45; Value2: 0.125W; SizeArea_mm2: 2.5; AEC Qualified: Y; VDC_V: 150V; AEC Category: Q200; AEC Grade: 0; Supplier Part Number 2: 52K9735; Supplier 2: Newark; Supplier Part Number 3: 71-CRCW0805-1.21K-E3; Supplier 3: Mouser; RoHS: E; Value1: 1%; MountType: SMT; Supplier 1: Digi-Key; PackageReference: 0805; Tolerance_%: 1%; Res_ohm: 1.21k; CompType: Resistor; PartNumber: CRCW08051K21FKEA; ComponentLink1Description: Datasheet link; Supplier Part Number 1: 541-1.21KCCT-ND; Technology: Thick Film; ComponentLink1URL: http://www.vishay.com/docs/20035/dcrcwe3.pdf
R93 R109 = CMP-0025834-4: RES, 5.1, 5%, 0.1 W, AEC-Q200 Grade 0, 0603; Manufacturer: Vishay-Dale; Power_W: 100mW; TempCo: 200 ppm/C; Value_Code: 5R10; Value: 5.1; EIA_Code: E24; SizeX_mm: 1.6; SizeY_mm: 0.8; SizeZ_mm: 1; Value2: 0.1W; SizeArea_mm2: 1.28; AEC Qualified: Y; VDC_V: 75V; AEC Category: Q200; AEC Grade: 0; Supplier Part Number 2: 59M6820; Supplier 2: Newark; Supplier Part Number 3: 71-CRCW0603J-5.1-E3; Supplier 3: Mouser; RoHS: E; Value1: 5%; MountType: SMT; Supplier 1: Digi-Key; PackageReference: 0603; Tolerance_%: 5%; Res_ohm: 5.1; CompType: Resistor; PartNumber: CRCW06035R10JNEA; ComponentLink1Description: Datasheet link; Supplier Part Number 1: 541-5.1GCT-ND; Technology: Thick Film; ComponentLink1URL: http://www.vishay.com/docs/20035/dcrcwe3.pdf
R94 R110 = CMP-0022170-4: RES, 1.00, 1%, 0.1 W, AEC-Q200 Grade 0, 0603; Manufacturer: Vishay-Dale; Power_W: 100mW; TempCo: 100 ppm/C; Value_Code: 1R00; Value: 1.00; EIA_Code: E96; Res_ohm: 1; SizeX_mm: 1.6; SizeY_mm: 0.8; Value2: 0.1W; SizeArea_mm2: 1.28; AEC Qualified: Y; VDC_V: 75V; AEC Category: Q200; AEC Grade: 0; Supplier Part Number 2: 71-CRCW06031R00FKEA; Supplier 2: Mouser; Supplier Part Number 3: 1616871; Supplier 3: Farnell; RoHS: E; Value1: 1%; MountType: SMT; Supplier 1: Newark; PackageReference: 0603; Tolerance_%: 1%; SizeZ_mm: 1; CompType: Resistor; PartNumber: CRCW06031R00FKEA; ComponentLink1Description: Datasheet link; Supplier Part Number 1: 52K8059; Technology: Thick Film; ComponentLink1URL: http://www.vishay.com/docs/20035/dcrcwe3.pdf
R95 R97 R98 R112-R114 = CMP-0023188-5: RES, 56.0, 1%, 0.1 W, 0603; Manufacturer: Yageo; Power_W: 100mW; TempCo: 100 ppm/C; Value_Code: 56R0; Value: 56.0; Res_ohm: 56; SizeX_mm: 1.6; SizeY_mm: 0.8; SizeZ_mm: 1; Value2: 0.1W; SizeArea_mm2: 1.28; AEC Qualified: N; VDC_V: 75V; AEC Category: Q200; SizeAreaWB_mm2: 4.68; Supplier Part Number 2: 603-RC0603FR-0756RL; Supplier 2: Mouser; Supplier Part Number 3: 9238336; Supplier 3: Farnell; RoHS: Y; Value1: 1%; MountType: SMT; Supplier 1: Digi-Key; PackageReference: 0603; Tolerance_%: 1%; CompType: Resistor; PartNumber: RC0603FR-0756RL; ComponentLink1Description: Datasheet link; Supplier Part Number 1: 311-56.0HRCT-ND; Technology: Thick Film; ComponentLink1URL: http://www.yageo.com/pdf/Pu-RC0603_51_PbFree_L_2.pdf; AEC Grade: N/A
R96 R105 R111 = CMP-0025701-4: RES, 10 k, 5%, 0.1 W, AEC-Q200 Grade 0, 0603; Manufacturer: Vishay-Dale; Power_W: 100mW; TempCo: 200 ppm/C; Value_Code: 10k0; Value: 10k; EIA_Code: E24; SizeX_mm: 1.6; SizeY_mm: 0.8; SizeZ_mm: 1; Value2: 0.1W; SizeArea_mm2: 1.28; AEC Qualified: Y; VDC_V: 75V; AEC Category: Q200; AEC Grade: 0; Supplier Part Number 2: 52K8066; Supplier 2: Newark; Supplier Part Number 3: 71-CRCW0603J-10K-E3; Supplier 3: Mouser; RoHS: E; Value1: 5%; MountType: SMT; Supplier 1: Digi-Key; PackageReference: 0603; Tolerance_%: 5%; Res_ohm: 10k; CompType: Resistor; PartNumber: CRCW060310K0JNEA; ComponentLink1Description: Datasheet link; Supplier Part Number 1: 541-10KGCT-ND; Technology: Thick Film; ComponentLink1URL: http://www.vishay.com/docs/20035/dcrcwe3.pdf
R99 R115 = CMP-0023037-5: RES, 33.0 k, 1%, 0.1 W, 0603; Manufacturer: Yageo; Power_W: 100mW; TempCo: 100 ppm/C; Value_Code: 33k0; Value: 33.0k; Res_ohm: 33k; SizeX_mm: 1.6; SizeY_mm: 0.8; SizeZ_mm: 1; Value2: 0.1W; SizeArea_mm2: 1.28; AEC Qualified: N; VDC_V: 75V; AEC Category: Q200; SizeAreaWB_mm2: 4.68; Supplier Part Number 2: 603-RC0603FR-0733KL; Supplier 2: Mouser; Supplier Part Number 3: 9238662; Supplier 3: Farnell; RoHS: Y; Value1: 1%; MountType: SMT; Supplier 1: Digi-Key; PackageReference: 0603; Tolerance_%: 1%; CompType: Resistor; PartNumber: RC0603FR-0733KL; ComponentLink1Description: Datasheet link; Supplier Part Number 1: 311-33.0KHRCT-ND; Technology: Thick Film; ComponentLink1URL: http://www.yageo.com/pdf/Pu-RC0603_51_PbFree_L_2.pdf; AEC Grade: N/A
R100 R102 R103 R117 = CMP-0021998-4: RES, 10.0 k, 1%, 0.1 W, AEC-Q200 Grade 0, 0603; Manufacturer: Vishay-Dale; Power_W: 100mW; TempCo: 100 ppm/C; Value_Code: 10k0; Value: 10.0k; EIA_Code: E96; Res_ohm: 10k; SizeX_mm: 1.6; SizeY_mm: 0.8; SizeZ_mm: 1; Value2: 0.1W; SizeArea_mm2: 1.28; AEC Qualified: Y; VDC_V: 75V; AEC Category: Q200; AEC Grade: 0; Supplier Part Number 2: 52K8062; Supplier 2: Newark; Supplier Part Number 3: 71-CRCW0603-10K-E3; Supplier 3: Mouser; RoHS: E; Value1: 1%; MountType: SMT; Supplier 1: Digi-Key; PackageReference: 0603; Tolerance_%: 1%; CompType: Resistor; PartNumber: CRCW060310K0FKEA; ComponentLink1Description: Datasheet link; Supplier Part Number 1: 541-10.0KHCT-ND; Technology: Thick Film; ComponentLink1URL: http://www.vishay.com/docs/20035/dcrcwe3.pdf
R101 R116 = CMP-0025933-5: RES, 5.6 k, 5%, 0.1 W, 0603; Manufacturer: Yageo; Power_W: 100mW; TempCo: 100 ppm/C; Value_Code: 5k60; Value: 5.6k; EIA_Code: E24; SizeX_mm: 1.6; SizeY_mm: 0.8; SizeZ_mm: 1; Value2: 0.1W; SizeArea_mm2: 1.28; AEC Qualified: N; VDC_V: 75V; AEC Category: Q200; SizeAreaWB_mm2: 4.68; Supplier Part Number 2: 603-RC0603JR-075K6L; Supplier 2: Mouser; Supplier Part Number 3: 9233474; Supplier 3: Farnell; RoHS: Y; Value1: 5%; MountType: SMT; Supplier 1: Digi-Key; PackageReference: 0603; Tolerance_%: 5%; Res_ohm: 5.6k; CompType: Resistor; PartNumber: RC0603JR-075K6L; ComponentLink1Description: Datasheet link; Supplier Part Number 1: 311-5.6KGRCT-ND; Technology: Thick Film; ComponentLink1URL: http://www.yageo.com/pdf/Pu-RC0603_51_PbFree_L_2.pdf; AEC Grade: N/A
R104 = CMP-0025753-4: RES, 20 k, 5%, 0.1 W, AEC-Q200 Grade 0, 0603; Manufacturer: Vishay-Dale; Power_W: 100mW; TempCo: 200 ppm/C; Value_Code: 20k0; Value: 20k; EIA_Code: E24; SizeX_mm: 1.6; SizeY_mm: 0.8; SizeZ_mm: 1; Value2: 0.1W; SizeArea_mm2: 1.28; AEC Qualified: Y; VDC_V: 75V; AEC Category: Q200; AEC Grade: 0; Supplier Part Number 2: 59M6783; Supplier 2: Newark; Supplier Part Number 3: 71-CRCW0603J-20K-E3; Supplier 3: Mouser; RoHS: E; Value1: 5%; MountType: SMT; Supplier 1: Digi-Key; PackageReference: 0603; Tolerance_%: 5%; Res_ohm: 20k; CompType: Resistor; PartNumber: CRCW060320K0JNEA; ComponentLink1Description: Datasheet link; Supplier Part Number 1: 541-20KGCT-ND; Technology: Thick Film; ComponentLink1URL: http://www.vishay.com/docs/20035/dcrcwe3.pdf
R106 R108 = CMP-0025754-4: RES, 20, 5%, 0.1 W, AEC-Q200 Grade 0, 0603; Manufacturer: Vishay-Dale; Power_W: 100mW; TempCo: 200 ppm/C; Value_Code: 20R0; Value: 20; EIA_Code: E24; SizeX_mm: 1.6; SizeY_mm: 0.8; SizeZ_mm: 1; Value2: 0.1W; SizeArea_mm2: 1.28; AEC Qualified: Y; VDC_V: 75V; AEC Category: Q200; AEC Grade: 0; Supplier Part Number 2: 59M6784; Supplier 2: Newark; Supplier Part Number 3: 71-CRCW0603J-20-E3; Supplier 3: Mouser; RoHS: E; Value1: 5%; MountType: SMT; Supplier 1: Digi-Key; PackageReference: 0603; Tolerance_%: 5%; Res_ohm: 20; CompType: Resistor; PartNumber: CRCW060320R0JNEA; ComponentLink1Description: Datasheet link; Supplier Part Number 1: 541-20GCT-ND; Technology: Thick Film; ComponentLink1URL: http://www.vishay.com/docs/20035/dcrcwe3.pdf
R107 = CMP-0025892-5: RES, 18 k, 5%, 0.1 W, 0603; Manufacturer: Yageo; Power_W: 100mW; TempCo: 100 ppm/C; Value_Code: 18k0; Value: 18k; EIA_Code: E24; SizeX_mm: 1.6; SizeY_mm: 0.8; SizeZ_mm: 1; Value2: 0.1W; SizeArea_mm2: 1.28; AEC Qualified: N; VDC_V: 75V; AEC Category: Q200; SizeAreaWB_mm2: 4.68; Supplier Part Number 2: 603-RC0603JR-0718KL; Supplier 2: Mouser; Supplier Part Number 3: 9233539; Supplier 3: Farnell; RoHS: Y; Value1: 5%; MountType: SMT; Supplier 1: Digi-Key; PackageReference: 0603; Tolerance_%: 5%; Res_ohm: 18k; CompType: Resistor; PartNumber: RC0603JR-0718KL; ComponentLink1Description: Datasheet link; Supplier Part Number 1: 311-18KGRCT-ND; Technology: Thick Film; ComponentLink1URL: http://www.yageo.com/pdf/Pu-RC0603_51_PbFree_L_2.pdf; AEC Grade: N/A
T3-T5 = CMP-0037531-1: Power Transformer 1: 1.3 3100Vrms 2W 6 Terminal Gull Wing SMD; Manufacturer: Bourns; DCR_ohm: 0.65; Ind_H: 475µH; Ns1toNp: 1:1.3; Rsec1_ohm: 0.8; SizeZ_mm: 4.5mm; AEC Qualified: No; Standoff Height: 0.1mm; PackageReference: SMT_XFRMR_7MM1_6MM5; PartNumber: PAD002-T764113S; RoHS: TRUE; Supplier 1: Digikey; Supplier 2: Mouser; Supplier Part Number 1: 118-PAD002-T764113SCT-ND; Supplier Part Number 2: 652-PAD002-T764113S; Part Number: PAD002-T764113S; datasheet: https://bourns.com/docs/product-datasheets/PAD00x-T764.pdf; Datasheet Path: datasheets/Trans-PAD002-T764113S.pdf; Digikey Description: PUSH-PULL FUNC-INSULTN 5V 1:1.3; Digikey Part Number: 118-PAD002-T764113SCT-ND; helpURL: https://upverter.com/upn/revision/0b477b52e0d4fb3f/; Lead Free: Yes; Mouser Part Number: 652-PAD002-T764113S; Operating Temperature Range: -40°C to +125°C; Voltage_Isolation_Vrms: 3100Vrms; ComponentLink1Description: Datasheet; ComponentLink1URL: https://bourns.com/docs/product-datasheets/PAD00x-T764.pdf
TP27-TP30 TP63 TP70-TP72 = CMP-0003968-1: Test Point, SMT; Manufacturer: Harwin; ComponentLink1URL: https://cdn.harwin.com/pdfs/S2751R.pdf; Key: S2751-46R; Publisher: Texas Instruments; Supplier Part Number 2: 76Y5390; Supplier 3: Mouser; Supplier 1: Digi-Key; CompType: Test Point; PackageReference: Test Point, SMT; LatestRevisionDate: 2017-03-09; RoHS: Y; Supplier Part Number 1: 952-2664-1-ND; Supplier Part Number 3: 855-S2751-46R; Supplier 2: Newark; MountType: SMT; PartNumber: S2751-46R; ComponentLink1Description: Datasheet Link
U20 U21 U27 = CMP-0076095-1: Low-Noise 1 A, 420 kHz Transformer Driver, DBV0006A (SOT-23-6); Manufacturer: Texas Instruments; Alternate PartNumber: SN6505BDBVT; SizeAreaWB_mm2: 14.82; SizeArea_mm2: 8.12; SizeZ_mm: 1.45; Green_REACh: Passed; SizeY_mm: 2.9; Green_Lifecycle: Active; U/M: EA; CompType: IC; SizeX_mm: 2.8; ComponentLink1Description: Datasheet Link; Green_EU RoHS: Passed; PackageReference: DBV0006A; PartNumber: SN6505BDBVR; Publisher: Texas Instruments; PackageDescription: SOT-23-6; Alternate Manufacturer: Texas Instruments; LatestRevisionDate: 2017-06-09; ComponentLink1URL: http://www.ti.com/lit/ds/symlink/sn6505b.pdf; MountType: SMT; Green_EU RoHS-2: Passed
U22 U25 = CMP-0089967-3: 650-V 30-mΩ GaN FET with Integrated Driver and Protection; Manufacturer: Texas Instruments; Standoff Height: 0mm; TJmax_C: +125°C; AEC Qualified: Yes; Nominal Supply Current: 16mA; Min Supply Voltage: 7.5V; SizeZ_mm: 1mm; AEC Category: Q200; Output Voltage: 520V; CompType: IC; Number Of Outputs: 1; Max Supply Voltage: 18V; AEC Grade: Grade 1; PackageReference: VQFN52; Datasheet Path: datasheets/IC-LMG3522R030Q.pdf; helpURL: https://upverter.com/upn/revision/5d47e7f0436b8598/; RoHS: UNKNOWN; ComponentLink3Description: Online Datasheet; Operating Temperature Range: -40°C to +125°C; ComponentLink1Description: Datasheet Link; ComponentLink3URL: http://www.ti.com/product/GPN/datasheet; ComponentLink2Description: Product Folder; ComponentLink2URL: http://www.ti.com/product/GPN; Part Number: LMG3522R050Q; ComponentLink1URL: http://www.ti.com/lit/ds/symlink/GPN.pdf
U23 U26 = CMP-04872-000092-1: DGTL ISO 5000VRMS 4CH GP 16SOIC; Manufacturer: Texas Instruments; Number of Channels: 4; Max Supply Voltage: 5.5V; Min Supply Voltage: 2.25V; Propagation Delay: 10.7ns; RoHS Compliant: Yes; Lead Free: Lead Free; Min Operating Temperature: -55°C; Number of Pins: 16; Max Operating Temperature: 125°C; Case/Package: SOIC; PartNumber: ISO7741FDW
U24 = CMP-0083794-2: Isolated Dual-Channel Gate Driver, DW0016B (SOIC-16); Alternate PartNumber: UCC21540DWR; Alternate Manufacturer: Texas Instruments; SizeArea_mm2: 107.12; SizeZ_mm: 2.65; AEC Category: Q200; SizeX_mm: 10.4; AEC Qualified: N; CompType: IC; SizeY_mm: 10.3; SizeAreaWB_mm2: 152.52; MountType: SMT; ComponentLink1URL: http://www.ti.com/lit/ds/symlink/ucc21540.pdf; PartNumber: UCC21540DW; ComponentLink2Description: Product Folder; ComponentLink3Description: Online Datasheet; ComponentLink2URL: http://www.ti.com/product/ucc21540; ComponentLink3URL: http://www.ti.com/product/ucc21540/datasheet; Manufacturer: Texas Instruments; PackageDescription: SOIC-16; PackageReference: DW0016B; ComponentLink1Description: Datasheet Link